# Altium schematic sheet bpf_main6.SchDoc: mcHF QRP Transceiver RF board
size A4; Author: K Atanassov; CompanyName: M0NKA; Revision: 0.6.3; SheetTotal: 12
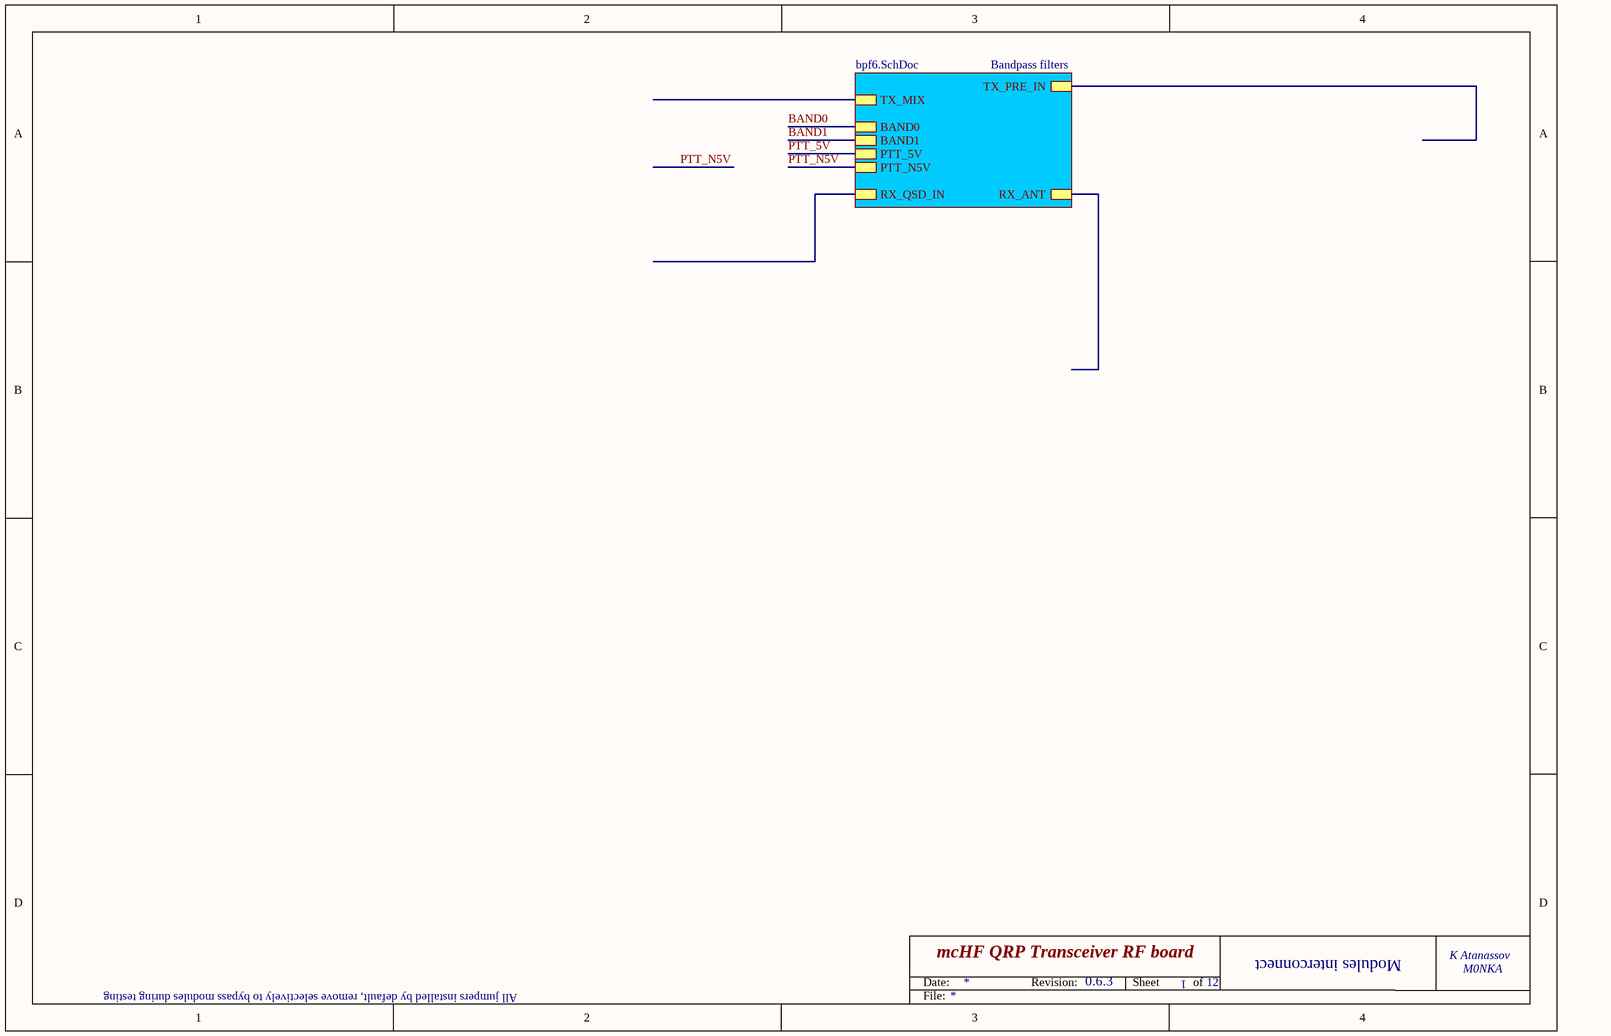
[diagram p0: bpf_main6.SchDoc]

## Sub-sheets
Bandpass filters = bpf6.SchDoc: RX_QSD_IN, BAND0, BAND1, PTT_5V, RX_ANT, TX_MIX, TX_PRE_IN, PTT_N5V

## Nets
BAND0: sheet Bandpass filters/BAND0
BAND1: sheet Bandpass filters/BAND1
PTT_5V: sheet Bandpass filters/PTT_5V
PTT_N5V: sheet Bandpass filters/PTT_N5V

## Notes on the sheet
- All jumpers installed by default, remove selectively to bypass modules during testing
- 1
- Modules interconnect
- Date:
- Revision:
- Sheet
- of
- File: